# EAGLE design badge2013 (EAGLE 5.10)
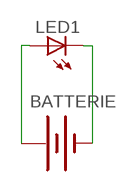
[diagram p0: schematic, sheet 1]

## Parts
BATTERIE  BATTERY12PTH  [BATTCON_12MM_PTH]
LED1  LED5MM  [LED5MM]

## Nets
N$1: BATTERIE.VCC@1(+) LED1.A
N$2: BATTERIE.GND(-) LED1.K(C)

## Library data of the parts
BATTERIE = sparkFun:BATTERY: Battery Holders Various common sizes : AA, AAA, 20mm coin cell and 12mm coin cell.
LED1 = sparkFun:LED: LEDs Standard schematic elements and footprints for 5mm, 3mm, 1206, and 0603 sized LEDs. 5mm - Spark Fun Electronics SKU : COM-00529 (and others)

## Board
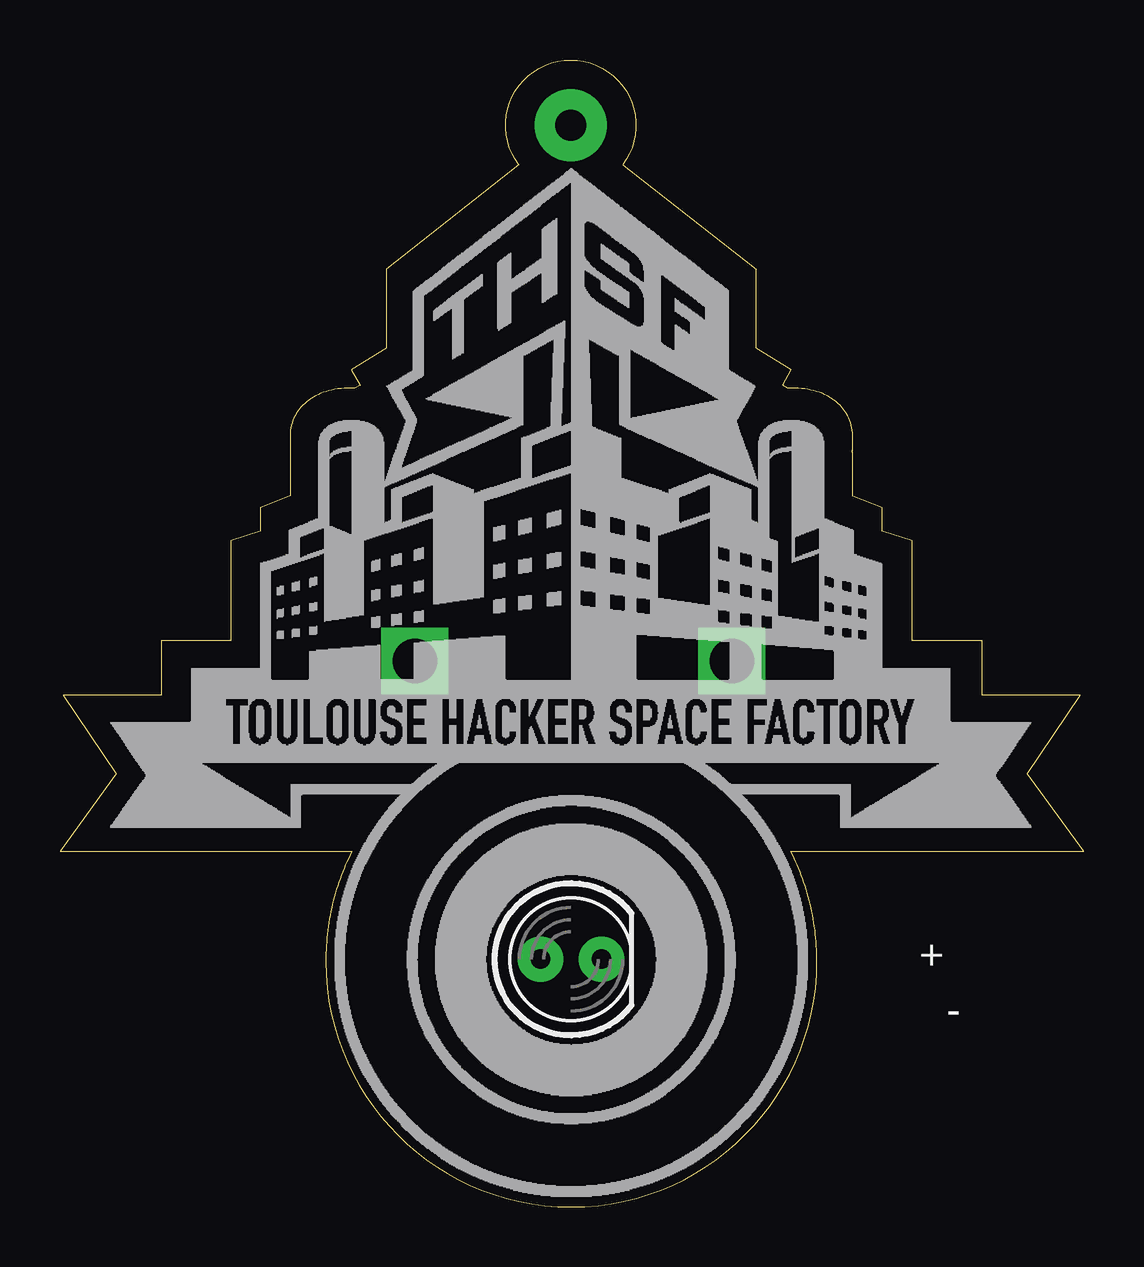
[diagram p1: board, top side]
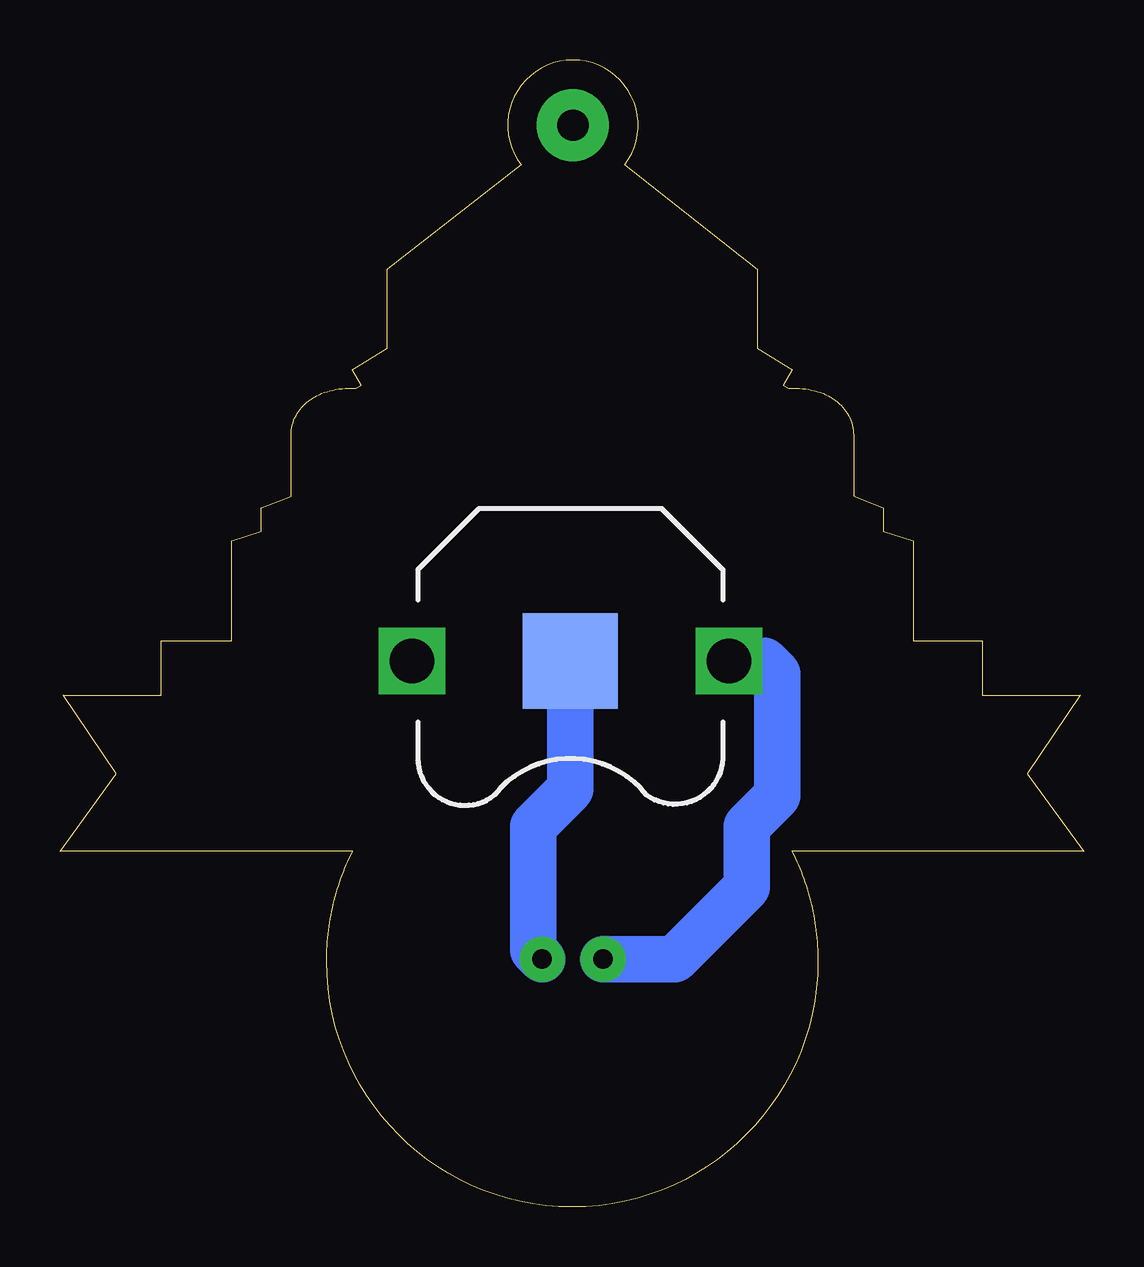
[diagram p2: board, bottom side, seen from below]

Size 42.65 x 47.79 mm. Coordinates in mm from the lower left corner, seen from the top.
Outline: 11.98,34.11 11.84,34.1 11.71,34.1 11.58,34.08 11.45,34.06 11.33,34.04 11.21,34.01 11.09,33.98 10.97,33.94 10.86,33.9 10.75,33.85 10.65,33.8 10.55,33.74 10.45,33.68 10.36,33.62 10.27,33.55 10.19,33.48 10.11,33.4 10.04,33.32 9.97,33.24 9.9,33.15 9.85,33.07 9.79,32.97 9.75,32.88 9.71,32.78 9.67,32.68 9.64,32.58 9.62,32.48 9.6,32.37 9.59,32.26 9.59,32.15 9.59,31.53 9.59,31.52 9.59,31.51 9.59,31.51 9.58,31.5 9.58,31.49 9.58,31.49 9.58,31.48 9.58,31.47 9.58,31.47 9.58,31.46 9.58,31.45 9.58,31.45 9.58,31.44 9.58,31.43 9.58,31.42 9.58,31.42 9.58,31.41 9.59,31.4 9.59,31.4 9.59,31.39 9.59,31.38 9.59,31.38 9.59,31.37 9.59,31.36 9.59,31.36 9.59,31.35 9.59,31.34 9.59,31.33 9.59,31.33 9.59,31.32 9.59,29.63 9.34,29.53 8.34,29.13 8.34,28.16 7.11,27.76 7.11,23.6 6.1,23.6 4.23,23.6 4.23,21.33 0.13,21.33 2.34,18.06 0,14.81 12.16,14.81 12.09,14.67 12.02,14.53 11.96,14.39 11.89,14.25 11.83,14.11 11.78,13.97 11.72,13.82 11.67,13.67 11.62,13.53 11.57,13.38 11.52,13.23 11.47,13.08 11.43,12.93 11.39,12.78 11.35,12.62 11.32,12.47 11.28,12.31 11.25,12.16 11.22,12 11.2,11.85 11.17,11.69 11.15,11.53 11.13,11.37 11.12,11.21 11.1,11.05 11.09,10.89 11.08,10.73 11.08,10.56 11.07,10.4 11.07,10.23 11.09,9.67 11.13,9.12 11.21,8.58 11.31,8.04 11.44,7.52 11.59,7 11.78,6.5 11.98,6.01 12.22,5.54 12.47,5.07 12.75,4.63 13.05,4.19 13.37,3.78 13.71,3.38 14.07,3 14.45,2.64 14.85,2.3 15.27,1.98 15.7,1.68 16.14,1.4 16.61,1.14 17.08,0.91 17.57,0.71 18.07,0.52 18.59,0.37 19.11,0.24 19.65,0.13 20.19,0.06 20.75,0.02 21.31,0 21.87,0.02 22.42,0.06 22.96,0.13 23.5,0.24 24.02,0.37 24.54,0.52 25.04,0.71 25.53,0.91 26.01,1.14 26.47,1.4 26.91,1.68 27.35,1.98 27.76,2.3 28.16,2.64 28.54,3 28.9,3.38 29.24,3.78 29.56,4.19 29.86,4.63 30.14,5.07 30.4,5.54 30.63,6.01 30.84,6.5 31.02,7 31.17,7.52 31.3,8.04 31.41,8.58 31.48,9.12 31.52,9.67 31.54,10.23 31.54,10.4 31.53,10.56 31.53,10.73 31.52,10.89 31.51,11.05 31.49,11.21 31.48,11.37 31.46,11.53 31.44,11.69 31.41,11.85 31.39,12 31.36,12.16 31.33,12.31 31.29,12.47 31.26,12.62 31.22,12.78 31.18,12.93 31.14,13.08 31.09,13.23 31.05,13.38 31,13.53 30.94,13.67 30.89,13.82 30.84,13.97 30.78,14.11 30.72,14.25 30.66,14.39 30.59,14.53 30.52,14.67 30.46,14.81 42.65,14.81 40.31,18.06 42.52,21.33 38.42,21.33 38.42,23.6 35.51,23.6 35.51,27.76 34.27,28.16 34.27,29.13 33.02,29.62 33.02,31.32 33.02,31.33 33.02,31.33 33.02,31.34 33.02,31.35 33.02,31.36 33.02,31.36 33.02,31.37 33.02,31.38 33.02,31.38 33.02,31.39 33.02,31.4 33.02,31.4 33.02,31.41 33.02,31.42 33.02,31.42 33.02,31.43 33.02,31.44 33.02,31.45 33.02,31.45 33.02,31.46 33.02,31.47 33.02,31.47 33.02,31.48 33.02,31.49 33.02,31.49 33.02,31.5 33.02,31.51 33.01,31.51 33.01,31.52 33.01,31.53 33.02,31.53 33.02,32.15 33.02,32.26 33.01,32.37 32.99,32.48 32.97,32.58 32.94,32.68 32.91,32.78 32.87,32.88 32.82,32.97 32.77,33.07 32.71,33.15 32.64,33.24 32.58,33.32 32.5,33.4 32.42,33.48 32.34,33.55 32.25,33.62 32.16,33.68 32.06,33.74 31.96,33.8 31.86,33.85 31.75,33.9 31.64,33.94 31.52,33.98 31.41,34.01 31.28,34.04 31.16,34.06 31.03,34.08 30.9,34.1 30.77,34.1 30.63,34.11 30.32,34.11 30.1,34.23 30.47,34.89 29.01,35.79 29.01,39.07 23.44,43.42 arc255 19.12,43.42 13.6,39.07 13.6,35.79 12.15,34.89 12.51,34.23 12.29,34.11 11.98,34.11
Outline: 11.98,34.11 11.98,34.11
Copper layers (1*16): Top 0.035mm / dielectric 1.5mm / Bottom 0.035mm
Design rules "default": minimum track width 10mil, minimum drill 24mil, track to track 8mil, track to pad 8mil, pad to pad 8mil, via to via 8mil, smd to smd 8mil, copper to edge 40mil, drill to drill 8mil, minimum pad ring 10mil, minimum via ring 8mil, stop-mask expansion 4mil, vias tented up to drill 0mil, thermal gap 10mil

### Footprints (pad centres in the part's own frame; a part is rotated, then mirrored left to right if it is on the bottom)
BATTCON_12MM_PTH = smd 3.962 x 3.962: GND 0,0 | drill 1.854 square: VCC@1 -6.604,0; VCC@2 6.604,0
LED5MM = drill 0.813 pad 1.88 round: A -1.27,0; K 1.27,0

### Placement (x,y rotation side)
BATTERIE  21.39,22.75 180 bottom
LED1  21.29,10.32 0 top

### Tracks (layer width: path | path; a pad name or v marks a point on that pad's centre or on a via)
N$1
  Bottom 1.93: BATTERIE.VCC@1 13.31,22.75 12.77,22.21 12.77,17.13 14.04,15.86 14.04,13.32 17.04,10.32 LED1.A
N$2
  Bottom 1.93: BATTERIE.GND 21.39,17.41 22.93,15.86 22.93,10.69 LED1.K
N$3  (via drill 1.3 pad 3)
  other vias: 21.28,45.07

### Text on the board
tNames: + | -
bNames: * WTF Licence Have Fun! * | OSHW design par machinarium.fr | Emploi: | Ajoute un peu de soudure sur l'emplacement | de la batterie, puis soude le support de la | pile bouton au verso. Insère ensuite le | clou par l'avant, puis soude le à l'arrière. | Soude ensuite la LED, la plus longue patte | sur le (+). Ajoute enfin la pile. Et voilà ! | Porte le badge où tu veux, et sois fière | de toi. Tu as la super classe !
202bmp: D:/Docs - Snootlab - Lionel/Eagle/JardinNum2013/silkscreen.bmp